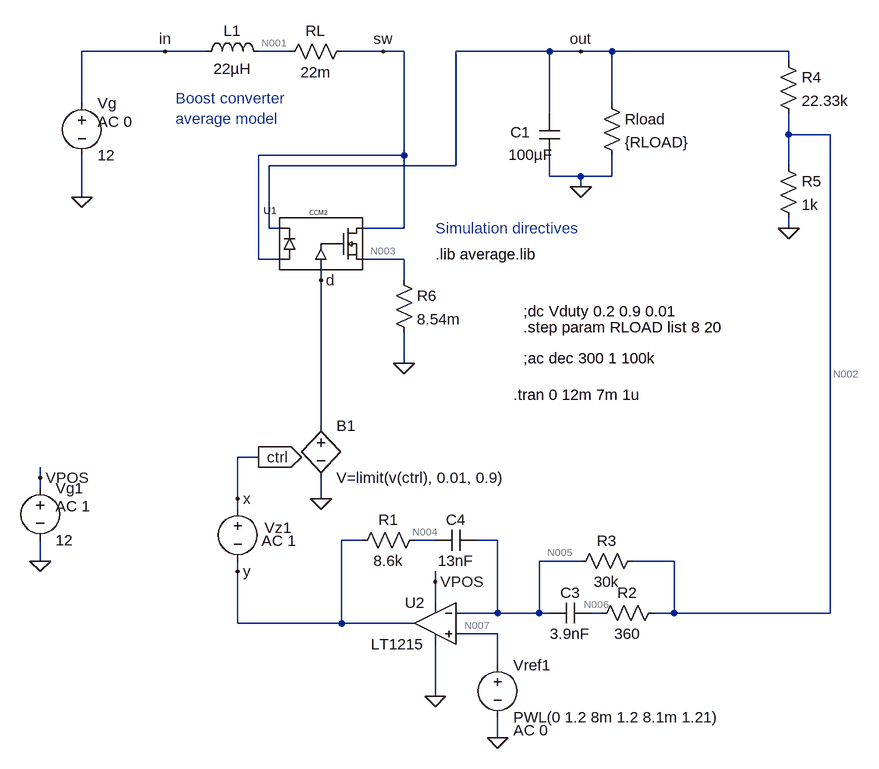
[diagram p0: schematic boost_average_CL.asc]
boost_average_CL.asc, the LTspice schematic file:
Version 4
SHEET 1 1848 724
WIRE 560 -352 432 -352
WIRE 624 -352 560 -352
WIRE 752 -352 704 -352
WIRE 896 -352 832 -352
WIRE 928 -352 896 -352
WIRE 1152 -352 1008 -352
WIRE 1200 -352 1152 -352
WIRE 1248 -352 1200 -352
WIRE 1520 -352 1248 -352
WIRE 1520 -336 1520 -352
WIRE 432 -272 432 -352
WIRE 1248 -272 1248 -352
WIRE 1152 -256 1152 -352
WIRE 1520 -224 1520 -256
WIRE 1584 -224 1520 -224
WIRE 928 -192 928 -352
WIRE 928 -192 704 -192
WIRE 1008 -176 1008 -352
WIRE 1008 -176 720 -176
WIRE 1520 -176 1520 -224
WIRE 1152 -160 1152 -192
WIRE 1200 -160 1152 -160
WIRE 1248 -160 1248 -192
WIRE 1248 -160 1200 -160
WIRE 1200 -144 1200 -160
WIRE 432 -128 432 -192
WIRE 720 -80 720 -176
WIRE 736 -80 720 -80
WIRE 928 -80 928 -192
WIRE 928 -80 864 -80
WIRE 1520 -80 1520 -96
WIRE 704 -32 704 -192
WIRE 736 -32 704 -32
WIRE 928 -32 864 -32
WIRE 800 0 800 -16
WIRE 928 0 928 -32
WIRE 928 128 928 80
WIRE 800 224 800 0
WIRE 704 272 672 272
WIRE 368 304 368 288
WIRE 368 320 368 304
WIRE 672 336 672 272
WIRE 800 336 800 304
WIRE 672 352 672 336
WIRE 864 400 832 400
WIRE 976 400 944 400
WIRE 1072 400 1040 400
WIRE 368 432 368 400
WIRE 1200 432 1136 432
WIRE 1344 432 1280 432
WIRE 672 448 672 432
WIRE 976 464 976 448
WIRE 976 496 976 464
WIRE 1072 512 1072 400
WIRE 1072 512 1008 512
WIRE 1136 512 1136 432
WIRE 1136 512 1072 512
WIRE 1152 512 1136 512
WIRE 1232 512 1216 512
WIRE 1344 512 1344 432
WIRE 1344 512 1312 512
WIRE 1584 512 1584 -224
WIRE 1584 512 1344 512
WIRE 672 528 672 448
WIRE 832 528 832 400
WIRE 832 528 672 528
WIRE 944 528 832 528
WIRE 1072 544 1008 544
WIRE 1072 592 1072 544
WIRE 976 640 976 560
WIRE 1072 704 1072 672
FLAG 928 128 0
FLAG 1200 -144 0
FLAG 432 -128 0
FLAG 1200 -352 out
FLAG 896 -352 sw
FLAG 800 0 d
FLAG 560 -352 in
FLAG 976 640 0
FLAG 1072 704 0
FLAG 976 464 VPOS
FLAG 800 336 0
FLAG 704 272 ctrl
IOPIN 704 272 Out
FLAG 672 336 x
FLAG 672 448 y
FLAG 1520 -80 0
FLAG 368 432 0
FLAG 368 304 VPOS
SYMBOL cap 1136 -256 R0
WINDOW 0 -44 28 Left 2
WINDOW 3 -47 63 Left 2
SYMATTR InstName C1
SYMATTR Value 100µF
SYMBOL res 1232 -288 R0
SYMATTR InstName Rload
SYMATTR Value {RLOAD}
SYMBOL ind 608 -336 R270
WINDOW 0 32 56 VTop 2
WINDOW 3 5 56 VBottom 2
SYMATTR InstName L1
SYMATTR Value 22µH
SYMBOL res 848 -368 R90
WINDOW 0 0 56 VBottom 2
WINDOW 3 32 56 VTop 2
SYMATTR InstName RL
SYMATTR Value 22m
SYMBOL voltage 432 -288 R0
WINDOW 123 24 44 Left 2
WINDOW 39 0 0 Left 0
SYMATTR Value2 AC 0
SYMATTR InstName Vg
SYMATTR Value 12
SYMBOL ccm1 800 -48 M0
SYMATTR InstName U1
SYMATTR Value CCM2
SYMATTR SpiceLine Ron=8m
SYMATTR SpiceLine2 VD=0.5 RD=0.05
SYMBOL Opamps\\LT1215 976 464 M0
SYMATTR InstName U2
SYMBOL cap 1216 496 R90
WINDOW 0 0 32 VBottom 2
WINDOW 3 32 32 VTop 2
SYMATTR InstName C3
SYMATTR Value 3.9nF
SYMBOL cap 1040 384 R90
WINDOW 0 0 32 VBottom 2
WINDOW 3 32 32 VTop 2
SYMATTR InstName C4
SYMATTR Value 13nF
SYMBOL res 960 384 R90
WINDOW 0 0 56 VBottom 2
WINDOW 3 32 56 VTop 2
SYMATTR InstName R1
SYMATTR Value 8.6k
SYMBOL res 1328 496 R90
WINDOW 0 0 56 VBottom 2
WINDOW 3 32 56 VTop 2
SYMATTR InstName R2
SYMATTR Value 360
SYMBOL res 1296 416 R90
WINDOW 0 0 56 VBottom 2
WINDOW 3 32 56 VTop 2
SYMATTR InstName R3
SYMATTR Value 30k
SYMBOL voltage 1072 576 R0
WINDOW 123 24 116 Left 2
WINDOW 39 0 0 Left 2
SYMATTR Value2 AC 0
SYMATTR InstName Vref1
SYMATTR Value PWL(0 1.2 8m 1.2 8.1m 1.21)
SYMBOL bv 800 208 R0
SYMATTR InstName B1
SYMATTR Value V=limit(v(ctrl), 0.01, 0.9)
SYMBOL voltage 672 336 R0
WINDOW 0 41 45 Left 2
WINDOW 123 37 65 Left 2
WINDOW 39 0 0 Left 2
SYMATTR InstName Vz1
SYMATTR Value2 AC 1
SYMATTR Value ""
SYMBOL res 1504 -352 R0
SYMATTR InstName R4
SYMATTR Value 22.33k
SYMBOL res 1504 -192 R0
SYMATTR InstName R5
SYMATTR Value 1k
SYMBOL res 912 -16 R0
SYMATTR InstName R6
SYMATTR Value 8.54m
SYMBOL voltage 368 304 R0
WINDOW 123 24 44 Left 2
WINDOW 39 0 0 Left 0
SYMATTR Value2 AC 1
SYMATTR InstName Vg1
SYMATTR Value 12
TEXT 976 -80 Left 2 ;Simulation directives
TEXT 976 -40 Left 2 !.lib average.lib
TEXT 576 -280 Left 2 ;Boost converter\naverage model
TEXT 1112 120 Left 2 !;ac dec 300 1 100k
TEXT 1112 72 Left 2 !.step param RLOAD list 8 20
TEXT 1112 48 Left 2 !;dc Vduty 0.2 0.9 0.01
TEXT 1096 176 Left 2 !.tran 0 12m 7m 1u

The netlist it stands for:
* boost_average_CL.asc
C1 out 0 100µF
Rload out 0 {RLOAD}
L1 in N001 22µH
RL sw N001 22m
Vg in 0 12 AC 0
XU1 sw N003 out sw d CCM2 Ron=8m VD=0.5 RD=0.05  ; pins 1 2 3 4 5
XU2 N007 N005 VPOS 0 y LT1215  ; pins In+ In- V+ V- OUT
C3 N006 N005 3.9nF
C4 N005 N004 13nF
R1 N004 y 8.6k
R2 N002 N006 360
R3 N002 N005 30k
Vref1 N007 0 PWL(0 1.2 8m 1.2 8.1m 1.21) AC 0
B1 d 0 V=limit(v(ctrl), 0.01, 0.9)
Vz1 x y AC 1
R4 out N002 22.33k
R5 N002 0 1k
R6 N003 0 8.54m
Vg1 VPOS 0 12 AC 1
* Simulation directives
.lib average.lib
* Boost converter
* average model
;ac dec 300 1 100k
.step param RLOAD list 8 20
;dc Vduty 0.2 0.9 0.01
.tran 0 12m 7m 1u
.lib LTC.lib
.backanno
.end

* Results of the author's LTspice run, read from the files saved beside the schematic
* Operating Point (first step), zero values left out:
*   rload = 8 
*   V(out) = 27.68 V
*   V(in) = 12 V
*   V(n001) = 11.99 V
*   V(sw) = 11.81 V
*   V(n003) = 42.43 mV
*   V(n005) = 1.2 V
*   V(n007) = 1.2 V
*   V(vpos) = 12 V
*   V(y) = 589.4 mV
*   V(n006) = 1.187 V
*   V(n004) = 589.4 mV
*   V(n002) = 1.187 V
*   V(d) = 589.4 mV
*   V(x) = 589.4 mV
*   I(L1) = 8.429 A
*   I(R6) = 4.968 A
*   I(R5) = 1.187 mA
*   I(R4) = 1.186 mA
*   I(R3) = -444 nA
*   I(Rl) = -8.429 A
*   I(Rload) = 3.459 A
*   I(Vg1) = -5.222 mA
*   I(Vref1) = 444 nA
*   I(Vg) = -8.429 A
*   Ix(u1:1) = 4.968 A
*   Ix(u1:2) = -4.968 A
*   Ix(u1:3) = -3.461 A
*   Ix(u1:4) = 3.461 A
*   Ix(u2:1) = -444 nA
*   Ix(u2:2) = -444 nA
*   Ix(u2:3) = 5.222 mA
*   Ix(u2:4) = -5.222 mA
*   Ix(u2:5) = 10.82 pA
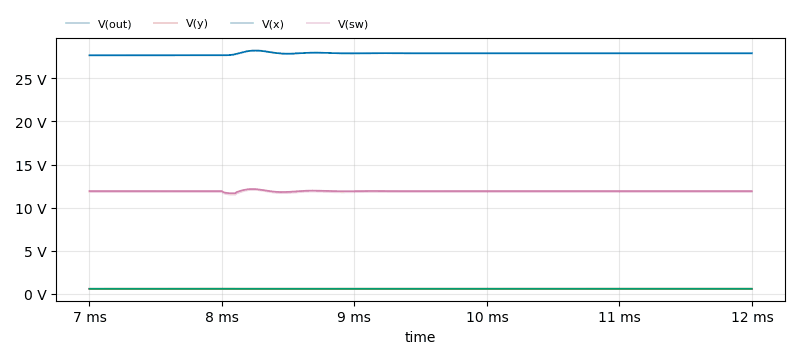
[diagram p1: Transient Analysis of boost_average_CL.asc, plotted from the saved traces]
* Transient Analysis, 2 runs:
*   V(out) [rload=8]: min 27.67 V, max 28.25 V, average 27.87 V, rms 27.87 V, last 27.91 V
*   V(out) [rload=20]: min 27.68 V, max 28.23 V, average 27.87 V, rms 27.87 V, last 27.91 V
*   V(y) [rload=8]: min 588.9 mV, max 603.1 mV, average 592.5 mV, rms 592.5 mV, last 593 mV
*   V(y) [rload=20]: min 580.1 mV, max 592.3 mV, average 583.1 mV, rms 583.1 mV, last 583.7 mV
*   V(x) [rload=8]: min 588.9 mV, max 603.1 mV, average 592.5 mV, rms 592.5 mV, last 593 mV
*   V(x) [rload=20]: min 580.1 mV, max 592.3 mV, average 583.1 mV, rms 583.1 mV, last 583.7 mV
*   V(sw) [rload=8]: min 11.48 V, max 12.06 V, average 11.8 V, rms 11.8 V, last 11.8 V
*   V(sw) [rload=20]: min 11.66 V, max 12.16 V, average 11.92 V, rms 11.92 V, last 11.92 V